# EAGLE design MicAmplifier (EAGLE 6.5.0)
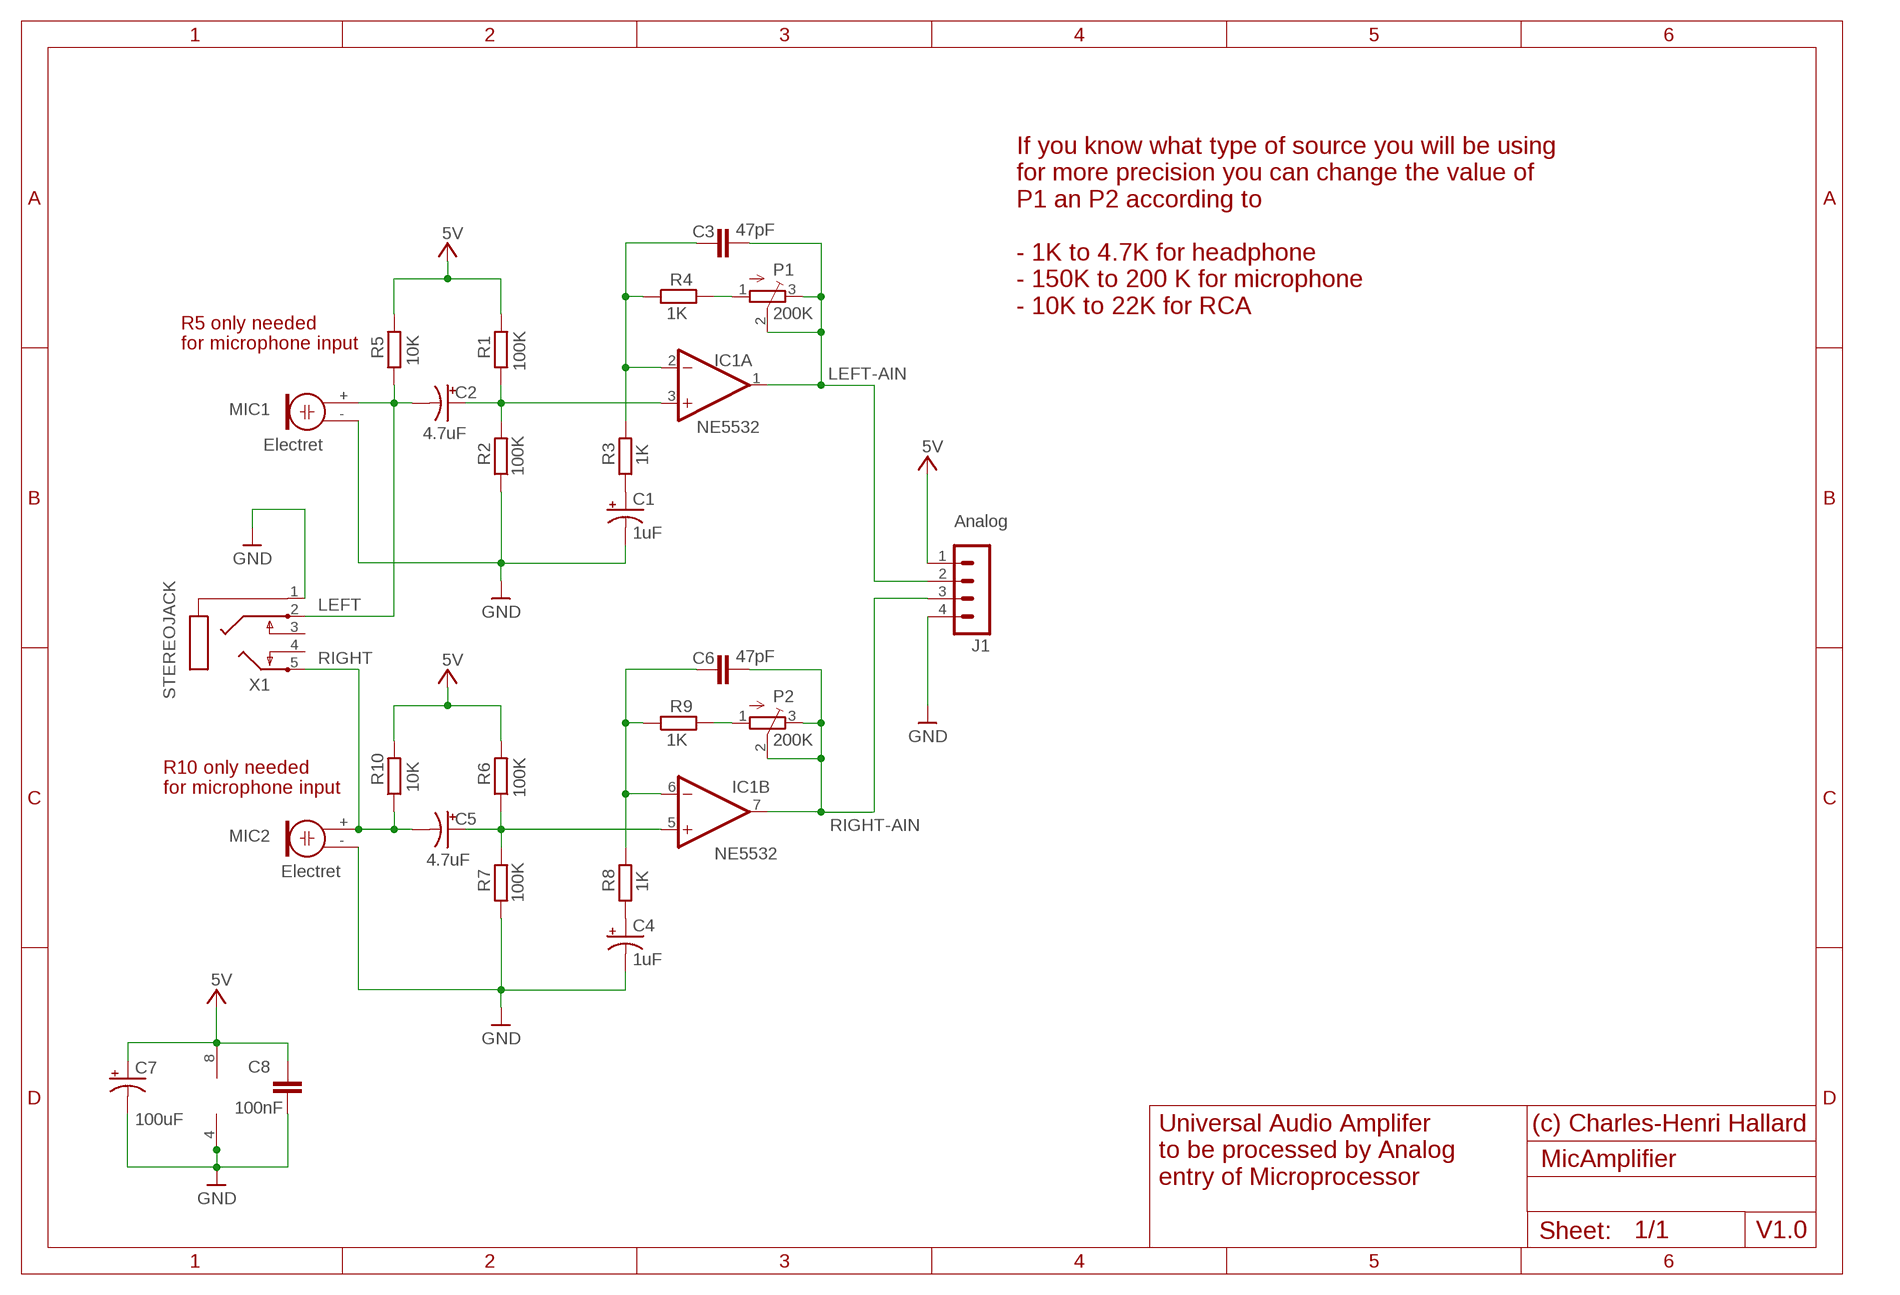
[diagram p0: schematic, sheet 1]

## Parts
C1  1uF  CAP_POL1206  [EIA3216]
C2  4.7uF  CAP_POL1206  [EIA3216]
C3  47pF  CAPACITOR_NPOL-0805  [C805]
C4  1uF  CAP_POL1206  [EIA3216]
C5  4.7uF  CAP_POL1206  [EIA3216]
C6  47pF  CAPACITOR_NPOL-0805  [C805]
C7  100uF  CAP_POLPTH2  [CPOL-RADIAL-10UF-25V]
C8  100nF  CAPACITOR_NPOL-0805  [C805]
IC1  NE5532  NE5532D  [SO08]
J1  Analog  M04_LOCK  [1X04_LOCK]
MIC1  Electret  ELECTRET  [9.7ELECTRET]
MIC2  Electret  ELECTRET  [9.7ELECTRET]
P1  200K  TRIMPOTTC33X  [TC33X]
P2  200K  TRIMPOTTC33X  [TC33X]
R1  100K  RESISTORR805-0805  [R805]
R2  100K  RESISTORR805-0805  [R805]
R3  1K  RESISTORR805-0805  [R805]
R4  1K  RESISTORR805-0805  [R805]
R5  10K  RESISTORR805-0805  [R805]
R6  100K  RESISTORR805-0805  [R805]
R7  100K  RESISTORR805-0805  [R805]
R8  1K  RESISTORR805-0805  [R805]
R9  1K  RESISTORR805-0805  [R805]
R10  10K  RESISTORR805-0805  [R805]
X1  STEREOJACK  [STX3100]

## Nets
+5V: C7.1(+) C8.2 IC1.8(P:V+) J1.1 R1.2 R5.2 R6.2 R10.2 ; supply symbol labelled 5V
GND: C1.C(-) C4.C(-) C7.2(-) C8.1 IC1.4(P:V-) J1.4 MIC1.- MIC2.- R2.1 R7.1 X1.1
LEFT: C2.C(-) MIC1.+ R5.1 X1.2
LEFT-AIN: C3.2 IC1.1(A:OUT) J1.2 P1.2(S) P1.3(E)
N$1: C2.A(+) IC1.3(A:+IN) R1.1 R2.2
N$2: C1.A(+) R3.1
N$3: C3.1 IC1.2(A:-IN) R3.2 R4.1
N$4: C5.A(+) IC1.5(B:+IN) R6.1 R7.2
N$7: P1.1(A) R4.2
N$8: C4.A(+) R8.1
N$9: C6.1 IC1.6(B:-IN) R8.2 R9.1
N$12: P2.1(A) R9.2
RIGHT: C5.C(-) MIC2.+ R10.1 X1.5
RIGHT-AIN: C6.2 IC1.7(B:OUT) J1.3 P2.2(S) P2.3(E)
Unconnected: X1.3 X1.4

## Notes on the sheet
- If you know what type of source you will be using
  for more precision you can change the value of
  P1 an P2 according to
- - 1K to 4.7K for headphone 
  - 150K to 200 K for microphone
  - 10K to 22K for RCA
- R5 only needed
  for microphone input
- R10 only needed
  for microphone input
- (c) Charles-Henri Hallard
- Universal Audio Amplifer
  to be processed by Analog
  entry of Microprocessor
- V1.0

## Library data of the parts
C1 C2 C4 C5 C7 = SparkFun-Passives:CAP_POL: Capacitor Polarized These are standard SMD and PTH capacitors. Normally 10uF, 47uF, and 100uF in electrolytic and tantalum varieties. Always verify the external diameter of the through hole cap, it varies with capacity, voltage, and manufacturer. The EIA devices should be standard.
C3 C6 C8 = dp_devices:CAPACITOR_NPOL: Non-Polarized capacitor in various packages
IC1 = linear:NE5532: AUDIO AMPLIFIER
J1 = _c2h:M04_LOCK
MIC1 MIC2 = adafruit:ELECTRET: Electret microphone Thru hole 2.54mm spacing with 9.7mm diameter
P1 P2 = adafruit:TRIMPOT: SMT trimmer potentiometer part number TC33X http://www.ladyada.net/library/eagle
R1-R10 = dp_devices:RESISTOR
X1 = adafruit:STEREOJACK: MIC/HEADPHONE JACK Stereo jack with two switches. Kycon STX3100, CUI SJ1-3555NG and/or 4UCon 05544

## Board
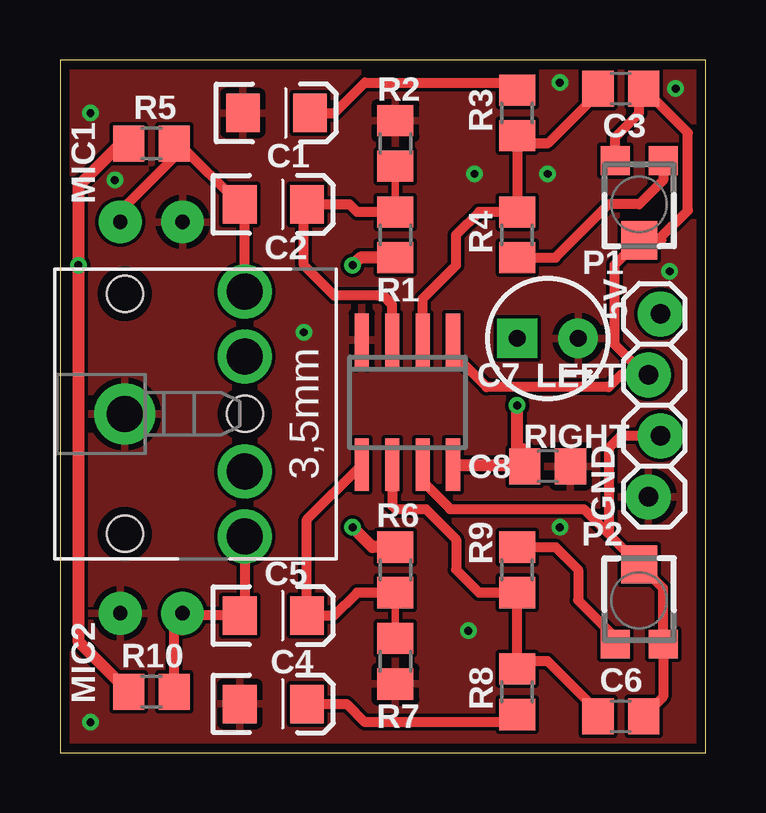
[diagram p1: board, top side]
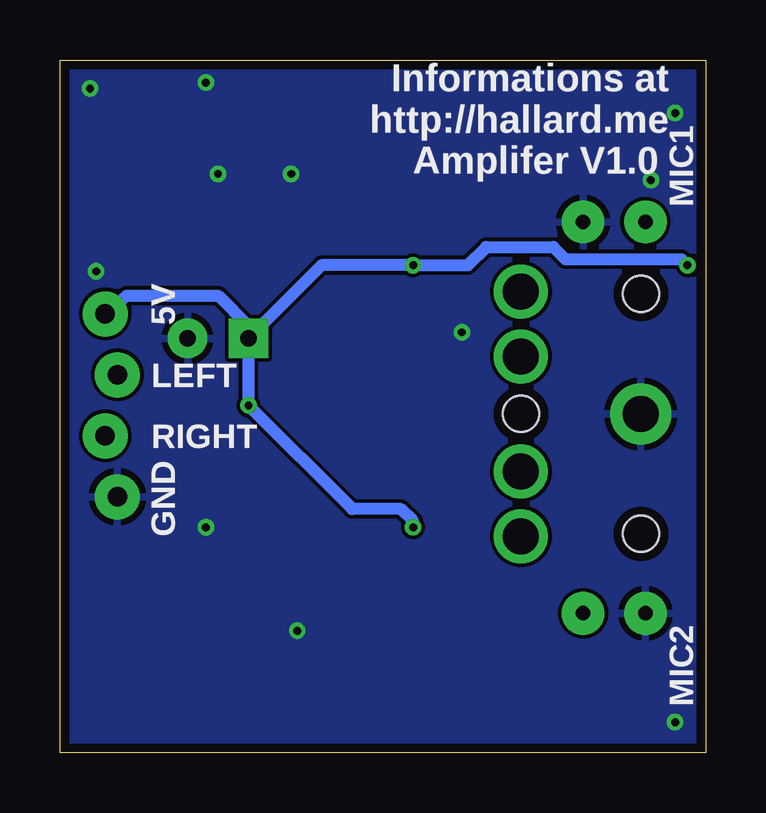
[diagram p2: board, bottom side, seen from below]

Size 26.9 x 28.88 mm. Coordinates in mm from the lower left corner, seen from the top.
Outline: 0,0 26.9,0 26.9,28.88 0,28.88 0,0
Copper layers (1*16): Top 0.0356mm / dielectric 1.5011mm / Bottom 0.0356mm
Design rules "oshpark": minimum track width 6mil, minimum drill 13mil, track to track 6mil, track to pad 6mil, pad to pad 6mil, via to via 6mil, smd to smd 6mil, copper to edge 15mil, drill to drill 6mil, minimum pad ring 7mil, minimum via ring 7mil, stop-mask expansion 3mil, vias tented up to drill 0mil, thermal gap 10mil

### Footprints (pad centres in the part's own frame; a part is rotated, then mirrored left to right if it is on the bottom)
EIA3216 = smd 1.4 x 1.6: A 1.4,0; C -1.4,0
C805 = smd 1.3 x 1.5: 1 -0.95,0; 2 0.95,0
CPOL-RADIAL-10UF-25V = drill 0.7 pad 1.651 square: 1 1.27,0 | drill 0.7 pad 1.651: 2 -1.27,0
SO08 = smd 0.6 x 2.2: 1 -1.905,-2.6; 2 -0.635,-2.6; 3 0.635,-2.6; 4 1.905,-2.6; 5 1.905,2.6; 6 0.635,2.6; 7 -0.635,2.6; 8 -1.905,2.6
1X04_LOCK = drill 0.813 pad 1.88: 1 1.27,1.397; 2 3.81,0.889; 3 6.35,1.397; 4 8.89,0.889
9.7ELECTRET = drill 0.6 pad 1.778: + 1.3,2; - -1.3,2
TC33X = smd 1.2 x 1.2: 1 -1,-1.825; 3 1,-1.825 | smd 1.5 x 1.6: 2 0,1.5
R805 = smd 1.3 x 1.5: 1 -0.95,0; 2 0.95,0
STX3100 = drill 1.5 pad 2.54: 1 2.7,-0.1 | drill 1.5: 2 7.7,5; 3 7.7,2.3; 4 7.7,-2.5; 5 7.7,-5.2 | hole 1.5: 2.7,4.9; 2.7,-5.1; 7.7,-0.1

### Placement (x,y rotation side)
C1  9.02,26.67 0 top
C2  8.89,22.86 0 top
C3  23.37,27.69 0 top
C4  8.89,2.03 0 top
C5  8.89,5.71 0 top
C6  23.37,1.52 0 top
C7  20.32,17.27 180 top
C8  20.32,11.94 180 top
IC1  14.48,14.61 180 top
J1  23.62,19.56 270 top
MIC1  3.81,24.13 180 top
MIC2  3.81,3.81 0 top
P1  24.13,22.86 180 top
P2  24.13,6.35 0 top
R1  13.97,21.59 270 top
R2  13.97,25.4 270 top
R3  19.05,26.67 270 top
R4  19.05,21.59 270 top
R5  3.81,25.4 180 top
R6  13.97,7.62 90 top
R7  13.97,3.81 90 top
R8  19.05,2.54 90 top
R9  19.05,7.62 90 top
R10  3.81,2.54 180 top
X1  0,14.22 0 top

### Tracks (layer width: path | path; a pad name or v marks a point on that pad's centre or on a via)
+5V  (via drill 0.33)
  Top 0.406: C8.2 19.37,12.38
  Top 0.508: R1.2 12.51,20.64 v12.19,20.32 | R6.2 13.02,8.57 v12.19,9.4 | 19.37,12.38 19.37,12.63 19.05,12.63 v19.05,14.48 | R5.2 2.54,25.4 0.76,23.62 v0.76,20.32 0.76,19.05 0.76,4.64 R10.2 | IC1.8 19.37,12.01 C8.2
  Bottom 0.508: C7.1 v19.05,14.48 14.73,10.16 12.7,10.16 12.19,9.65 v12.19,9.4 | C7.1 16,20.32 v12.19,20.32 9.91,20.32 9.14,21.08 6.35,21.08 5.84,20.57 1.02,20.57 v0.76,20.32 | C7.1 19.05,17.78 20.32,19.05 24.13,19.05 J1.1
GND  (via drill 0.33)
  other vias: 20.32,24.13 20.83,9.4 25.4,20.07 10.16,17.53 17.02,5.08 17.27,24.13 1.27,1.27 1.27,26.67 20.83,27.94 25.65,27.69 2.29,23.88
  pour Top: -1.27,29.21 27.94,29.21 27.94,-1.27 -1.27,-1.27
  pour Bottom: -1.27,29.21 -1.27,-1.27 27.94,-1.27 27.94,29.21
LEFT
  Top 0.406: MIC1.+ 2.51,22.58 4.83,24.89 4.83,25.33 R5.1 4.95,25.4 C2.C 7.7,22.65 X1.2
LEFT-AIN
  Top 0.305: 16.51,16.51 16.51,17.08 IC1.1 | 24.92,21.36 25.12,21.36 | J1.2 24.38,15.75
  Top 0.406: P1.3 23.13,25.67 24.13,26.67 24.13,27.5 C3.2 26.16,25.84 26.16,22.61 24.92,21.36 P1.2 23.11,20.34 23.11,17.02 24.38,15.75 | 16.51,16.51 17.78,15.24 22.86,15.24 23.37,15.75 J1.2 25.15,15.75
N$1
  Top 0.305: R1.1 R2.2
  Top 0.406: R1.1 12.38,22.54 12.06,22.86 C2.A 10.16,22.73 10.16,20.32 11.43,19.05 13.46,19.05 13.84,18.67 IC1.3
N$2
  Top 0.406: R3.1 19.37,27.62 19.05,27.94 12.7,27.94 11.43,26.67 C1.A
N$3
  Top 0.406: C3.1 22.42,27.5 20.32,25.4 19.37,25.4 R3.2 R4.1 17.46,22.54 16.51,21.59 16.51,20.32 15.11,18.92 IC1.2
N$4
  Top 0.305: R7.2 R6.1
  Top 0.406: IC1.5 10.29,9.72 C5.A 11.43,5.71 12.38,6.67 R6.1
N$7
  Top 0.406: P1.1 25.13,23.86 24.13,22.86 22.86,22.86 20.64,20.64 R4.2
N$8
  Top 0.406: R8.1 19.37,1.59 19.05,1.27 12.7,1.27 11.94,2.03 C4.A
N$9
  Top 0.305: 13.84,10.29 13.97,10.16
  Top 0.406: C6.1 22.42,1.71 20.32,3.81 19.37,3.81 R8.2 R9.1 17.46,6.67 16.51,7.62 16.51,8.89 15.24,10.16 13.97,10.16 | IC1.6 13.84,10.29
N$12
  Top 0.305: P2.1 23.13,4.81
  Top 0.406: 23.13,4.81 21.59,6.35 21.59,7.62 20.64,8.57 R9.2
RIGHT
  Top 0.406: 5.08,5.08 5.08,5.78 MIC2.+ | MIC2.+ 5.21,5.71 C5.C 7.7,5.92 X1.5 | R10.1 4.76,5.46 MIC2.+
RIGHT-AIN
  Top 0.305: P2.2 23.9,7.85 | IC1.7 15.11,11.3 | 22.86,9.12 22.98,9.01
  Top 0.406: C6.2 25.13,2.34 P2.3 25.13,6.85 P2.2 22.98,9.01 | 15.11,11.3 16.26,10.16 21.82,10.16 22.86,9.12 22.86,12.7 23.37,13.21 J1.3

### Text on the board
tNames: 5V | LEFT | RIGHT | GND
bNames: Informations at / http://hallard.me / Amplifer V1.0 | MIC1 | 5V | LEFT | RIGHT | GND | MIC2